# Altium schematic sheet inversor.SchDoc
size 420 x 297 mm; SheetNumber: 3; SheetTotal: 8; ENG_APP_DATE: --/--/--; DSN_APP_DATE: --/--/--; CHK_APP_DATE: --/--/--
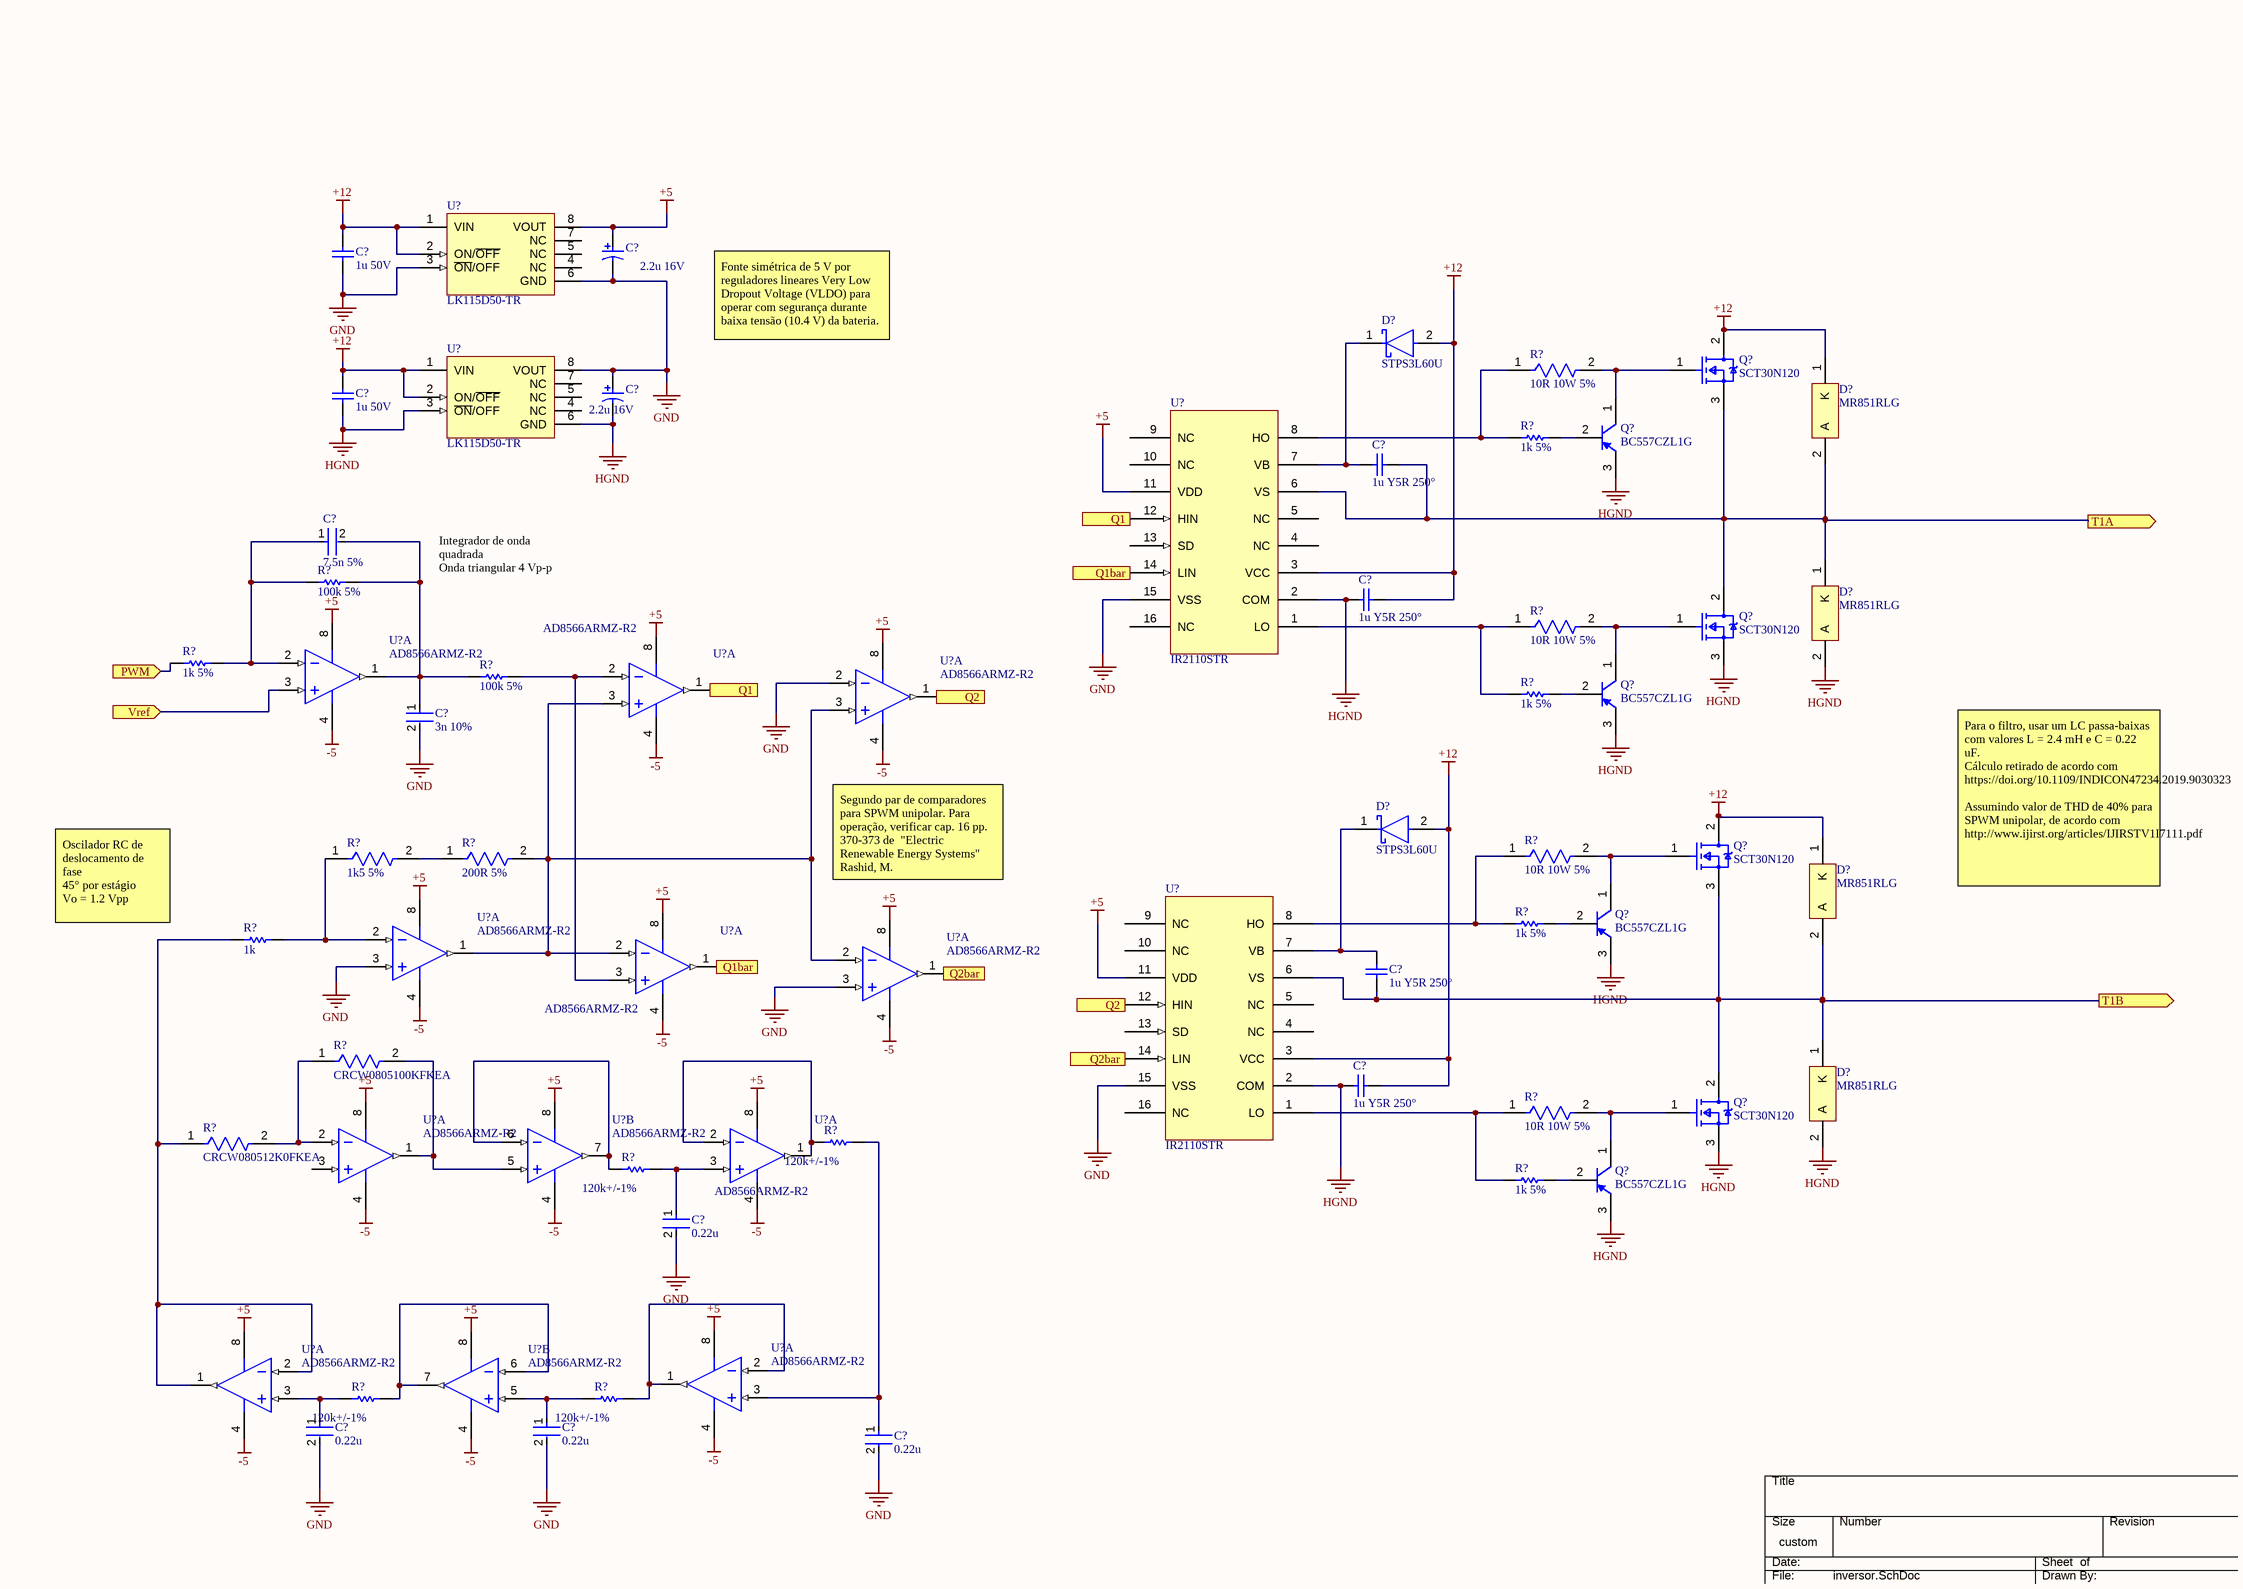
[diagram p0: inversor.SchDoc]

## Parts
(Parts that share a designator on the sheet are numbered #1, #2 ... from top to bottom, then left to right.)
C?#1  2.2u 16V  [KEMT-T491-A_L]
C?#2  1u 50V  [CAPC2013X135X45LL10T25]
C?#3  2.2u 16V  [KEMT-T491-A_L]
C?#4  1u 50V  [CAPC2013X135X45LL10T25]
C?#5  1u Y5R 250°  [CAPC2013X140X50ML20T25]
C?#6  7.5n 5%  [FP-C0805C-DN-MFG]
C?#7  1u Y5R 250°  [CAPC2013X140X50ML20T25]
C?#8  3n 10%  [FP-C0805C-DN-MFG]
C?#9  1u Y5R 250°  [CAPC2013X140X50ML20T25]
C?#10  1u Y5R 250°  [CAPC2013X140X50ML20T25]
C?#11  0.22u  [FP-GRM155-0_05-IPC_C]
C?#12  0.22u  [FP-GRM155-0_05-IPC_C]
C?#13  0.22u  [FP-GRM155-0_05-IPC_C]
C?#14  0.22u  [FP-GRM155-0_05-IPC_C]
D?#1  STPS3L60U  [FP-SMB-MFG]
D?#2  MR851RLG  [ONSC-AXIAL_LEAD-2-267-05_V]
D?#3  MR851RLG  [ONSC-AXIAL_LEAD-2-267-05_V]
D?#4  STPS3L60U  [FP-SMB-MFG]
D?#5  MR851RLG  [ONSC-AXIAL_LEAD-2-267-05_V]
D?#6  MR851RLG  [ONSC-AXIAL_LEAD-2-267-05_V]
Q?#1  SCT30N120
Q?#2  BC557CZL1G  [ONSC-TO-92-3-29-11_AM_BL]
Q?#3  SCT30N120
Q?#4  BC557CZL1G  [ONSC-TO-92-3-29-11_AM_BL]
Q?#5  SCT30N120
Q?#6  BC557CZL1G  [ONSC-TO-92-3-29-11_AM_BL]
Q?#7  SCT30N120
Q?#8  BC557CZL1G  [ONSC-TO-92-3-29-11_AM_BL]
R?#1  10R 10W 5%  [FP-CRCW2512-e3-IPC_A]
R?#2  1k 5%  [RESC3216X70X50LL05T20]
R?#3  100k 5%  [RESC3216X70X50LL05T20]
R?#4  10R 10W 5%  [FP-CRCW2512-e3-IPC_A]
R?#5  1k 5%  [RESC3216X70X50LL05T20]
R?#6  100k 5%  [RESC3216X70X50LL05T20]
R?#7  1k 5%  [RESC3216X70X50LL05T20]
R?#8  10R 10W 5%  [FP-CRCW2512-e3-IPC_A]
R?#9  1k5 5%  [FP-CR1206-IPC_C]
R?#10  200R 5%  [FP-CRCW1206-e3-IPC_A]
R?#11  1k 5%  [RESC3216X70X50LL05T20]
R?#12  1k  [RESC3216X60X45NL10T20]
R?#13  CRCW0805100KFKEA  [FP-CRCW0805-e3-MFG]
R?#14  10R 10W 5%  [FP-CRCW2512-e3-IPC_A]
R?#15  120k+/-1%  [RESC1609X50X30NL10T20]
R?#16  CRCW080512K0FKEA  [FP-CRCW0805-e3-IPC_A]
R?#17  120k+/-1%  [RESC1609X50X30NL10T20]
R?#18  1k 5%  [RESC3216X70X50LL05T20]
R?#19  120k+/-1%  [RESC1609X50X30NL10T20]
R?#20  120k+/-1%  [RESC1609X50X30NL10T20]
U?#1  LK115D50-TR  [SO8_M]
U?#2  LK115D50-TR  [SO8_M]
U?#3  IR2110STR
U?#4  AD8566ARMZ-R2  [ADI-RM-8_L]  (part A of 2)
U?#5  AD8566ARMZ-R2  [ADI-RM-8_L]  (part A of 2)
U?#6  AD8566ARMZ-R2  [ADI-RM-8_L]  (part A of 2)
U?#7  AD8566ARMZ-R2  [ADI-RM-8_L]  (part A of 2)
U?#8  AD8566ARMZ-R2  [ADI-RM-8_L]  (part A of 2)
U?#9  AD8566ARMZ-R2  [ADI-RM-8_L]  (part A of 2)
U?#10  IR2110STR
U?#11  AD8566ARMZ-R2  [ADI-RM-8_L]  (part A of 2)
U?#12  AD8566ARMZ-R2  [ADI-RM-8_L]  (part B of 2)
U?#13  AD8566ARMZ-R2  [ADI-RM-8_L]  (part A of 2)
U?#14  AD8566ARMZ-R2  [ADI-RM-8_L]  (part A of 2)
U?#15  AD8566ARMZ-R2  [ADI-RM-8_L]  (part A of 2)
U?#16  AD8566ARMZ-R2  [ADI-RM-8_L]  (part B of 2)

## Ports
PWM (in), Q1 (in), Q1 (out), Q1bar (in), Q1bar (out), Q2 (in), Q2 (out), Q2bar (in), Q2bar (out), T1A (out), T1B (out), Vref (in)

## Nets
+5: C?#1.1 U?#1.8(VOUT) U?#3.11(VDD) U?#4.8(+V) U?#5.8(+V) U?#6.8(+V) U?#7.8(+V) U?#8.8(+V) U?#9.8(+V) U?#10.11(VDD) U?#11.8(+V) U?#12.8(+V) U?#13.8(+V) U?#14.8(+V) U?#15.8(+V) U?#16.8(+V)
+12: C?#2.2 C?#4.2 C?#7.2 C?#10.2 D?#1.2(A) D?#2.1(K) D?#4.2(A) D?#5.1(K) Q?#1.2(D) Q?#5.2(D) U?#1.1(VIN) U?#1.2(ON/~{OFF}) U?#2.1(VIN) U?#2.2(ON/~{OFF}) U?#3.3(VCC) U?#10.3(VCC)
-5: U?#4.4(-V) U?#5.4(-V) U?#6.4(-V) U?#7.4(-V) U?#8.4(-V) U?#9.4(-V) U?#11.4(-V) U?#12.4(-V) U?#13.4(-V) U?#14.4(-V) U?#15.4(-V) U?#16.4(-V)
GND: C?#1.2 C?#2.1 C?#3.1 C?#8.2 C?#11.2 C?#12.2 C?#13.2 C?#14.2 U?#1.3(~{ON}/OFF) U?#1.6(GND) U?#2.8(VOUT) U?#3.15(VSS) U?#6.2(-IN_A) U?#7.3(+IN_A) U?#9.3(+IN_A) U?#10.15(VSS)
HGND: C?#3.2 C?#4.1 C?#7.1 C?#10.1 D?#3.2(A) D?#6.2(A) Q?#2.3(E) Q?#4.3(E) Q?#6.3(E) Q?#8.3(E) U?#2.3(~{ON}/OFF) U?#2.6(GND) U?#3.2(COM) U?#10.2(COM)
PWM: R?#5.1 ; port PWM
Q1: U?#3.12(HIN) U?#5.1(OUT_A) ; port Q1
Q1bar: U?#3.14(LIN) U?#8.1(OUT_A) ; port Q1bar
Q2: U?#6.1(OUT_A) U?#10.12(HIN) ; port Q2
Q2bar: U?#9.1(OUT_A) U?#10.14(LIN) ; port Q2bar
T1A: C?#5.2 D?#2.2(A) D?#3.1(K) Q?#1.3(S) Q?#3.2(D) U?#3.6(VS) ; port T1A
T1B: C?#9.2 D?#5.2(A) D?#6.1(K) Q?#5.3(S) Q?#7.2(D) U?#10.6(VS) ; port T1B
Vref: U?#4.3(+IN_A) ; port Vref
NetC?#5_1: C?#5.1 D?#1.1(K) U?#3.7(VB)
NetC?#6_1: C?#6.1 R?#3.1 R?#5.2 U?#4.2(-IN_A)
NetC?#6_2: C?#6.2 C?#8.1 R?#3.2 R?#6.1 U?#4.1(OUT_A)
NetC?#9_1: C?#9.1 D?#4.1(K) U?#10.7(VB)
NetC?#11_1: C?#11.1 R?#17.2 U?#13.3(+IN_A)
NetC?#12_1: C?#12.1 R?#19.1 U?#15.3(+IN_A)
NetC?#13_1: C?#13.1 R?#20.1 U?#16.5(+IN_B)
NetC?#14_1: C?#14.1 R?#15.2 U?#14.3(+IN_A)
NetQ?#1_1: Q?#1.1(G) Q?#2.1(C) R?#1.2
NetQ?#2_2: Q?#2.2(B) R?#2.2
NetQ?#3_1: Q?#3.1(G) Q?#4.1(C) R?#4.2
NetQ?#4_2: Q?#4.2(B) R?#7.2
NetQ?#5_1: Q?#5.1(G) Q?#6.1(C) R?#8.2
NetQ?#6_2: Q?#6.2(B) R?#11.2
NetQ?#7_1: Q?#7.1(G) Q?#8.1(C) R?#14.2
NetQ?#8_2: Q?#8.2(B) R?#18.2
NetR?#1_1: R?#1.1 R?#2.1 U?#3.8(HO)
NetR?#4_1: R?#4.1 R?#7.1 U?#3.1(LO)
NetR?#6_2: R?#6.2 U?#5.2(-IN_A) U?#8.3(+IN_A)
NetR?#8_1: R?#8.1 R?#11.1 U?#10.8(HO)
NetR?#9_1: R?#9.1 R?#12.2 U?#7.2(-IN_A)
NetR?#9_2: R?#9.2 R?#10.1
NetR?#10_2: R?#10.2 U?#5.3(+IN_A) U?#7.1(OUT_A) U?#8.2(-IN_A)
NetR?#12_1: R?#12.1 R?#16.1 U?#15.1(OUT_A) U?#15.2(-IN_A)
NetR?#13_1: R?#13.1 R?#16.2 U?#11.2(-IN_A)
NetR?#13_2: R?#13.2 U?#11.1(OUT_A) U?#12.5(+IN_B)
NetR?#14_1: R?#14.1 R?#18.1 U?#10.1(LO)
NetR?#15_1: R?#15.1 U?#13.1(OUT_A) U?#13.2(-IN_A)
NetR?#17_1: R?#17.1 U?#12.6(-IN_B) U?#12.7(OUT_B)
NetR?#19_2: R?#19.2 U?#16.6(-IN_B) U?#16.7(OUT_B)
NetR?#20_2: R?#20.2 U?#14.1(OUT_A) U?#14.2(-IN_A)
NetU?#6_3: U?#6.3(+IN_A) U?#9.2(-IN_A)

Not connected (* = marked no-connect by the designer): Q?#3 3(S); Q?#7 3(S); U?#1 4(NC) 5(NC) 7(NC); U?#2 4(NC) 5(NC) 7(NC); U?#3 4(NC) 5(NC) 9(NC) 10(NC) 13(SD) 16(NC); U?#10 4(NC) 5(NC) 9(NC) 10(NC) 13(SD) 16(NC); U?#11 3(+IN_A)

## Notes on the sheet
- Fonte simétrica de 5 V por reguladores lineares Very Low Dropout Voltage (VLDO) para operar com segurança durante baixa tensão (10.4 V) da bateria.
- Integrador de onda quadrada
  Onda triangular 4 Vp-p
- Oscilador RC de deslocamento de fase
  45° por estágio
  Vo = 1.2 Vpp
- Segundo par de comparadores para SPWM unipolar. Para operação, verificar cap. 16 pp. 370-373 de  "Electric Renewable Energy Systems" Rashid, M.
- Para o filtro, usar um LC passa-baixas com valores L = 2.4 mH e C = 0.22 uF.
  Cálculo retirado de acordo com https://doi.org/10.1109/INDICON47234.2019.9030323
  Assumindo valor de THD de 40% para SPWM unipolar, de acordo com http://www.ijirst.org/articles/IJIRSTV1I7111.pdf
- Labels drawn without touching a wire or pin: HGND
- THIS DOCUMENT AND THE DATA DISCLOSED HEREIN OR
- HEREWITH IS THE PROPERTY OF ALTIUM LIMITED AND MAY
- DWG NO:
- REVISION
- REV:
- DESCRIPTION
- DATE
- APPROVED
- BE FREELY DISTRIBUTED IN WHOLE. NO RIGHTS ARE
- RESERVED OR EXPRESS OR IMPLIED WARANTEE GIVEN.
- ENG:
- APPROVALS
- PROJECT
- DSN:
- CHK:
- REFERENCE DOCUMENTS
- PROJECT REVISION:
- TITLE
- DOCUMENT REVISION:
- DESIGN ITEM:
- BOM:
- FAB DWG:
- PCB DWG:
- ASSY DWG:
- SCALE:
- A3
- SIZE
- CAGE CODE
- FILE NAME
- DWG NO.
- SHEET
- OF
- REV

## Library data of the parts
C?#1 C?#3 = CMP-2000-07187-1: Tantalum Capacitor, 2.2 uF, +/- 10%, 16 V, -55 to 125 degC, 2-Pin SMD, RoHS, Tape and Reel; Manufacturer: Kemet; Capacitance: 2200000pF; Product Depth (mm): 1.6mm; DCL: 0.4uA; Wire Form: NotRequired; Case Style: Molded; ESR: 6ohm; Polarity: Polar; Product Length (mm): 3.2mm; Voltage: 16VDC; Lead Spacing (nom): NotRequiredmm; DF: 6%; Rad Hardened: No; Operating Temp Range: -55Cto125C; Datasheet Version: 10/2016; Packaging: TapeandReel; Mounting Style: SurfaceMount; Manufacturer URL: http://www.kemet.com/; Seal: NotRequired; Product Height (mm): 1.6mm; Construction: SMTChip; Length W/Weld: NotRequiredmm; Package Reference: T491-A; Package Description: 2-Pin Surface Mount Device, Body 3.2 x 1.6 mm; Tolerance (+ or -): 10%; Length W/Weld (max): NotRequiredmm; Insulation: NotRequired; Mounting Technology: SurfaceMount; Package / Case: 3216-18; Seated Plane Height: NotRequiredmm; Case Code: A; Datasheet URL: http://capacitoredge.kemet.com/capedge2/DataSheet/Datasheet-T491A225K016AT.pdf?pn=T491A225K016AT; Product Diameter (mm): NotRequiredmm; Failure Rate: NotRequired
C?#2 C?#4 = CMP-1036-04761-2: Manufacturer: Murata; Part Number: GRM21BR71H105KA12L
C?#5 C?#7 C?#9 C?#10 = CMP-2007-03241-1: Part Number: C0805C105Z4VACTU; Manufacturer: Kemet
C?#6 = CMP-03020-018062-1: C0805 7,500 pF C0G 30ppm/°C 1.00% 250 V; Manufacturer Part Number: C0805C752FAGAC7210; Manufacturer: KEMET; Material: Ceramic; Tolerance: 0.01; Voltage Rating: 250 V; Value: 7,500 pF; Temperature: -55°C to +125°C; Temperature Characteristic: C0G; Octopart: https://octopart.com/c0805c752fagac7210-kemet-105787804; Temperature Range Low: -55°C; Device Class L1: Passive Components; Category: Cap; ComponentLink2Description: Datasheet; ComponentLink2URL: https://content.kemet.com/datasheets/KEM_C1003_C0G_SMD.pdf; Temperature Range High: +125°C; RoHS: TRUE; Lead Free: Yes; Device Class L2: Capacitors; Device Class L3: Ceramic Capacitors; Temperature Coefficient: 30ppm/°C; Capacitance: 7,500 pF; Automotive: No; Ipc Land Pattern Name: CAPC200125X78; Height: 0.88mm; Package: C0805C-DN; Mouser Description: Multilayer Ceramic Capacitors MLCC - SMD/SMT 250volts 7.5nF 1% C0G
C?#8 = CMP-1036-03378-2: CAP CER 3000PF 25V NP0 0805; Manufacturer: KEMET; Manufacturer Part Number: C0805C302K3GACTU; Material: Ceramic; Temperature Characteristic: C0G; Tolerance: 0.1; Temperature Coefficient: 30ppm/°C; Capacitance: 3,000 pF; Value: 3,000 pF; RoHS: TRUE; Height: 0.88mm; Mouser Description: Multilayer Ceramic Capacitors MLCC - SMD/SMT 25volts 3000pF 10% C0G; Device Class L1: Passive Components; Temperature: -55°C to +125°C; Category: Cap; Package: C0805C-DN; Temperature Range High: +125°C; ComponentLink2URL: https://content.kemet.com/datasheets/KEM_C1003_C0G_SMD.pdf; Octopart: https://octopart.com/c0805c302k3gactu-kemet-17005149; Automotive: No; ComponentLink2Description: Datasheet; Device Class L3: Ceramic Capacitors; Digikey Description: CAP CER 3000PF 25V NP0 0805; Temperature Range Low: -55°C; Voltage Rating: 25 V; Device Class L2: Capacitors; Ipc Land Pattern Name: CAPC200125X78; Lead Free: Yes
C?#11-C?#14 = CMP-1034-02089-3: Chip Multilayer Ceramic Capacitors for General Purpose, 0402, 0.22uF, X7R, 15%, 10%, 16V; Capacitance: 220nF; Depth: 0.5mm; Dielectric: X7R; Min Operating Temperature: -55°C; Package Quantity: 1; Termination: SMD/SMT; Mount: Surface Mount; Radiation Hardening: No; Height: 0.5mm; Case Code (Metric): 1005; Packaging: Tape and Reel; Material: Ceramic; Voltage: 16V; Voltage Rating (DC): 16V; REACH SVHC: No SVHC; Voltage Rating: 16V; Length: 1mm; Tolerance: 10%; Thickness: 0.022inch; Case Code (Imperial): 0402; Max Operating Temperature: 125°C; Width: 0.02inch; Lead Free: Lead Free; Case/Package: 0402
D?#1 D?#4 = CMP-12187-000023-1: DIODE SCHOTTKY 60V 3A SMB; Manufacturer: STMicroelectronics; Standoff Height: 0.05mm; Peak Reverse Current: 150uA; Max Junction Temp: +150°C; Max Surge Forward Current: 100A; Octopart: https://octopart.com/stps3l60u-stmicroelectronics-334329; Category: Diode; Height: 2.65mm; RoHS: TRUE; Mouser Description: Schottky diode Configuration: Single Housing type: DO-214AA=SMB Peak conducting-state current: 100 A; Forward Current: 3A; Manufacturer Part Number: STPS3L60U; Temperature: to +150°C; ComponentLink2URL: https://www.st.com/resource/en/datasheet/stps3l60.pdf; Max Repetitive Reverse Voltage: 60V; Device Class L1: Discrete Semiconductors; Automotive: No; Device Class L3: Schottky Diodes; Digikey Description: DIODE SCHOTTKY 60V 3A SMB; Lead Free: Yes; Temperature Range High: +150°C; Package: SMB; ComponentLink2Description: Datasheet; Device Class L2: Diodes
D?#2 D?#3 D?#5 D?#6 = CMP-0902-00056-1: Fast Recovery Rectifier, 2-Pin Axial_Lead, Pb-Free, Tape and Reel; Manufacturer: On Semiconductor; IO(rec) Max (A): 3; VRRM Max (V): 100; ComponentLink1URL: http://www.onsemi.com/; PartNumber: MR851RLG; ComponentLink1Description: Manufacturer URL; ComponentLink2URL: http://www.onsemi.com/pub_link/Collateral/MR850-D.PDF; DatasheetVersion: Rev. 6; PackageDescription: 2-Pin, Axial Lead, Diameter 5.05 mm; ComponentLink3URL: http://www.onsemi.com/pub_link/Collateral/267-05.PDF; Type: Fast Recovery; IFSM Max (A): 100; ComponentLink3Description: Package Specification; PackageReference: AXIAL_LEAD-2-267-05; RoHS: TRUE; Mounting Technology: Through Hole; ComponentLink2Description: Datasheet; Packing: Tape and Reel; PackageVersion: Rev. G, 06/2000
Q?#1 Q?#3 Q?#5 Q?#7 = SCT30N120: Trans MOSFET N-CH 1.2KV 45A 3-Pin HIP-247 Tube; Manufacturer: STMicroelectronics; Continuous Drain Current (ID): 40A; Rds On Max: 100mR; Input Capacitance: 1.7nF; Max Power Dissipation: 270W; Gate to Source Voltage (Vgs): 25V; Element Configuration: Single; Number of Channels: 1; Drain to Source Resistance: 80mR; Fall Time: 28ns; Rise Time: 20ns; Turn-Off Delay Time: 45ns; Turn-On Delay Time: 19ns; Threshold Voltage: 2.6V; Power Dissipation: 175W; Supplier 1: Digi-Key; Manufacturer Part Number: SCT30N120; RoHS: Yes; Category: MOSFETs; Stock 1: 580; Pricing 1: 1=21.25000, 10=19.53200, 25=18.72200, 100=16.49560, 500=16.10000 (USD); Mount: Through Hole; Case/Package: TO-247-3; Number of Pins: 247; Weight: 1.340411oz; Min Operating Temperature: -55°C; Max Operating Temperature: 200°C; Drain to Source Voltage (Vdss): 1.2kV; Packaging: Rail/Tube; Drain to Source Breakdown Voltage: 1.2kV; Package Quantity: 30; Number of Elements: 1; Lead Free: Lead Free; REACH SVHC: No SVHC; ComponentLink1URL: https://datasheet.ciiva.com/46422/1856099-46422059.pdf?src-supplier=Element14; ComponentLink1Description: https://datasheet.ciiva.com/46422/1856099-46422059.pdf?src-supplier=Element14; Supplier Part Number 1: 497-14960-ND
Q?#2 Q?#4 Q?#6 Q?#8 = CMP-1048-01521-1: Amplifier Transistor, PNP Silicon, 3-Pin TO-92, Pb-Free, Ammo Box; Manufacturer: On Semiconductor; IC Continuous (A): -0.1; ComponentLink2Description: Datasheet; ComponentLink1URL: http://www.onsemi.com/; Mounting Technology: Through Hole; PartNumber: BC557CZL1G; Packing: Ammo Box; DatasheetVersion: Rev. 3; PackageVersion: Rev. AM; ComponentLink3URL: http://www.onsemi.com/pub_link/Collateral/MAC97-D.PDF; ComponentLink1Description: Manufacturer URL; Polarity: PNP; RoHS: TRUE; PackageReference: TO-92-3-29-11_AM_BL; PackageDescription: 3-Pin Transistor Outline, Body 4.825 x 3.685 mm, Pitch 1.27 mm; ComponentLink2URL: http://www.onsemi.com/pub_link/Collateral/BC556B-D.PDF; ComponentLink3Description: Package Specification
R?#1 R?#4 R?#8 R?#14 = CMP-02407-002524-1: RES Thick Film, 10Ω, 5%, 1W, 200ppm/°C, 2512; Voltage Rating (DC): 500V; Case/Package: 2512; Min Operating Temperature: -55°C; Number of Pins: 2; Lead Free: Lead Free; Radiation Hardening: No; Composition: Thick Film; Mount: Surface Mount; Package Quantity: 1; Case Code (Imperial): 2512; Voltage Rating: 500V; Termination: SMD/SMT; Length: 6.3mm; Number of Terminations: 2; Packaging: Tape and Reel; Temperature Coefficient: 200ppm/°C; Height: 0.028inch; Tolerance: 5%; Features: Automotive AEC-Q200; Case Code (Metric): 6432; Power Rating: 1W; Weight: 0.001429oz; Max Operating Temperature: 155°C; Depth: 3.15mm; Max Power Dissipation: 1W; Military Standard: Not; Width: 0.124inch; Resistance: 10R; Contact Plating: Tin
R?#2 R?#5 R?#7 R?#11 R?#18 = CMP-2003-00544-1: Manufacturer: Panasonic; Part Number: ERJ-8GEYJ102V
R?#3 R?#6 = CMP-2003-00546-1: Part Number: ERJ-8GEYJ104V; Manufacturer: Panasonic
R?#9 = CMP-07231-004406-1: Thick Film Chip Resistors 1206 1.5kΩ 0.25W 5% 200ppm/°C; Power Rating: 250mW; Voltage Rating: 200V; Resistance: 1.5kR; Features: Moisture Resistant; Width: 0.063inch; Max Operating Temperature: 155°C; Thickness: 610um; Military Standard: Not; Length: 3.2mm; Package Quantity: 5000; Contact Plating: Tin; Height: 0.03inch; Radiation Hardening: No; Tolerance: 5%; Mount: Surface Mount; Temperature Coefficient: 200ppm/°C; Max Power Dissipation: 250mW; Case Code (Metric): 3216; Termination: SMD/SMT; Packaging: Tape and Reel; Number of Terminations: 2; Case/Package: 1206; Min Operating Temperature: -55°C; Case Code (Imperial): 1206; Depth: 1.6mm; Composition: Thick Film
R?#10 = CMP-2003-01937-2: RES Thick Film, 200Ω, 5%, 0.25W, 200ppm/°C, 1206; Voltage Rating: 200V; Power Rating: 250mW; Mount: Surface Mount; Contact Plating: Tin; Tolerance: 5%; Features: Automotive AEC-Q200; Number of Terminations: 2; Package Quantity: 1; Case/Package: 1206; Lead Free: Lead Free; Temperature Coefficient: 200ppm/°C; Radiation Hardening: No; Resistance: 200R; Military Standard: Not; Depth: 1.6mm; Min Operating Temperature: -55°C; Height: 0.024inch; Max Operating Temperature: 155°C; Composition: Thick Film; Voltage Rating (DC): 200V; Case Code (Imperial): 1206; Case Code (Metric): 3216; Width: 1.6mm; Number of Pins: 2; Max Power Dissipation: 250mW; Length: 3.2mm; Weight: 0.000353oz; Packaging: Tape and Reel
R?#12 = CMP-2003-01868-1: Part Number: CRCW12061K00JNEA; Manufacturer: Vishay Dale
R?#13 = CMP-2001-04899-2: RES Thick Film, 100kΩ, 1%, 0.125W, 100ppm/°C, 0805; Resistance: 100kR; Power Rating: 125mW; Voltage Rating: 150V; Case/Package: 0805; Max Operating Temperature: 155°C; Case Code (Imperial): 0805; Lead Free: Lead Free; Weight: 0.000194oz; Number of Pins: 2; Package Quantity: 5000; Height: 0.45mm; Composition: Thick Film; Military Standard: Not; Tolerance: 1%; Case Code (Metric): 2012; Termination: SMD/SMT; Mount: Surface Mount; Radiation Hardening: No; Width: 1.25mm; Length: 2mm; Depth: 1.25mm; Packaging: Tape and Reel; Min Operating Temperature: -55°C; Contact Plating: Tin; Temperature Coefficient: 100ppm/°C; Voltage Rating (DC): 150V
R?#15 R?#17 R?#19 R?#20 = CMP-2000-03868-1: Manufacturer: Vishay Dale; Part Number: CRCW0603120KFKEA
R?#16 = CMP-2001-04934-2: RES Thick Film, 12kΩ, 1%, 0.125W, 100ppm/°C, 0805; Power Rating: 125mW; Voltage Rating (DC): 150V; Resistance: 12kR; Height: 0.45mm; Temperature Coefficient: 100ppm/°C; Min Operating Temperature: -55°C; Case/Package: 0805; Case Code (Imperial): 0805; Contact Plating: Tin; Tolerance: 1%; Weight: 0.000194oz; Max Operating Temperature: 155°C; Features: Automotive AEC-Q200; Mount: Surface Mount; Composition: Thick Film; Max Power Dissipation: 125mW; Number of Terminations: 2; Military Standard: Not; Package Quantity: 10; Width: 0.049inch; Lead Free: Lead Free; Length: 2mm; Depth: 1.25mm; Packaging: Tape and Reel; Radiation Hardening: No; Case Code (Metric): 2012; Voltage Rating: 150V; Termination: SMD/SMT
U?#1 U?#2 = CMP-0244-00225-1: 100mA, Very Low Drop (0.2V) with Inhibit Voltage Regulator, 5V, 8-Pin SO, Tape and Reel; ComponentLink2URL: http://www.st.com/internet/com/TECHNICAL_RESOURCES/TECHNICAL_LITERATURE/DATASHEET/CD00000547.pdf; ComponentLink2Description: Datasheet; PackageDescription: 8-Pin Small Outline Integrated Circuit 1.27 mm Pitch; DatasheetVersion: 1/07/2008; ComponentLink3Description: Package Specification; PackageReference: SO8; Code_IPC: SOIC127P600-8; ComponentLink1Description: Manufacturer URL; ComponentLink3URL: http://www.st.com/internet/com/TECHNICAL_RESOURCES/TECHNICAL_LITERATURE/PACKAGE_INFORMATION/CD00004680.pdf; PackageVersion: 1/12/2002; ComponentLink1URL: http://www.st.com; Code_JEDEC: MS-012-AA
U?#3 U?#10 = IR2110STR: Driver 500V 2.5A 2-OUT Hi/Lo Side Non-Inv 16-Pin SOIC W T/R; Manufacturer: International Rectifier; Number of Outputs: 2; Max Supply Voltage: 20V; Min Supply Voltage: 10V; Rise Time: 35ns; Propagation Delay: 150ns; Fall Time: 25ns; Power Dissipation: 1.25W; Turn-On Delay Time: 10ns; Operating Supply Voltage: 15V; Supplier 1: Bison Technologies; Manufacturer Part Number: IR2110STR; RoHS: No; Category: Gate Drivers; Stock 1: 485; Mount: Surface Mount; Case/Package: SOIC; Number of Pins: 16; Min Operating Temperature: -40°C; Max Operating Temperature: 125°C; Max Output Current: 2.5A; Number of Drivers: 2; Packaging: Tape and Reel; Package Quantity: 1000; Series: -; Turn-Off Delay Time: 10ns; RoHS Compliant: No; ComponentLink1URL: https://datasheet.ciiva.com/1953/ir2110-1953993.pdf?src-supplier=Digi-Key; ComponentLink1Description: https://datasheet.ciiva.com/1953/ir2110-1953993.pdf?src-supplier=Digi-Key; Supplier Part Number 1: IR2110STR-94544-INTERNATIONAL RECTIFIER (IR)
U?#4-U?#9 U?#11-U?#16 = CMP-0384-01637-1: Double Channel Single-Supply Operation Operational Amplifier, 5 MHz BW, 6 V/us SR, Industrial, 8-pin SOP (RM-8), Reel; Manufacturer: Analog Devices; Generic Part Number: AD8566; Amplifiers Per Package: 2; Iq/Amp: 850uA; Slew Rate: 6V/us; Small Signal Bandwidth: 5MHz; V Span Max: 16V; Input Bias Current: 600nA; Input Offset Voltage: 2mV; Automotive Qualified: Yes; V Span Min: 4.5V; DatasheetVersion: Rev. G; ComponentLink3Description: Package Specification; ComponentLink2Description: Datasheet; Code_JEDEC: MO-187-AA; PackageReference: RM-8; ComponentLink1URL: http://www.analog.com/en/index.html; PackageDescription: 8-Pin Mini Small Outline Package, Body 3 x 3 mm, Pitch 0.65 mm; Mounting Technology: Surface Mount; PartNumber: AD8566ARMZ-R2; ComponentLink3URL: http://www.analog.com/static/imported-files/packages/PKG_PDF/MSOP%28RM%29/RM_8.pdf; ComponentLink1Description: Manufacturer URL; ComponentLink2URL: http://www.analog.com/static/imported-files/data_sheets/AD8565_8566_8567.pdf